# EAGLE design SimpleSwitch (EAGLE 6.4)
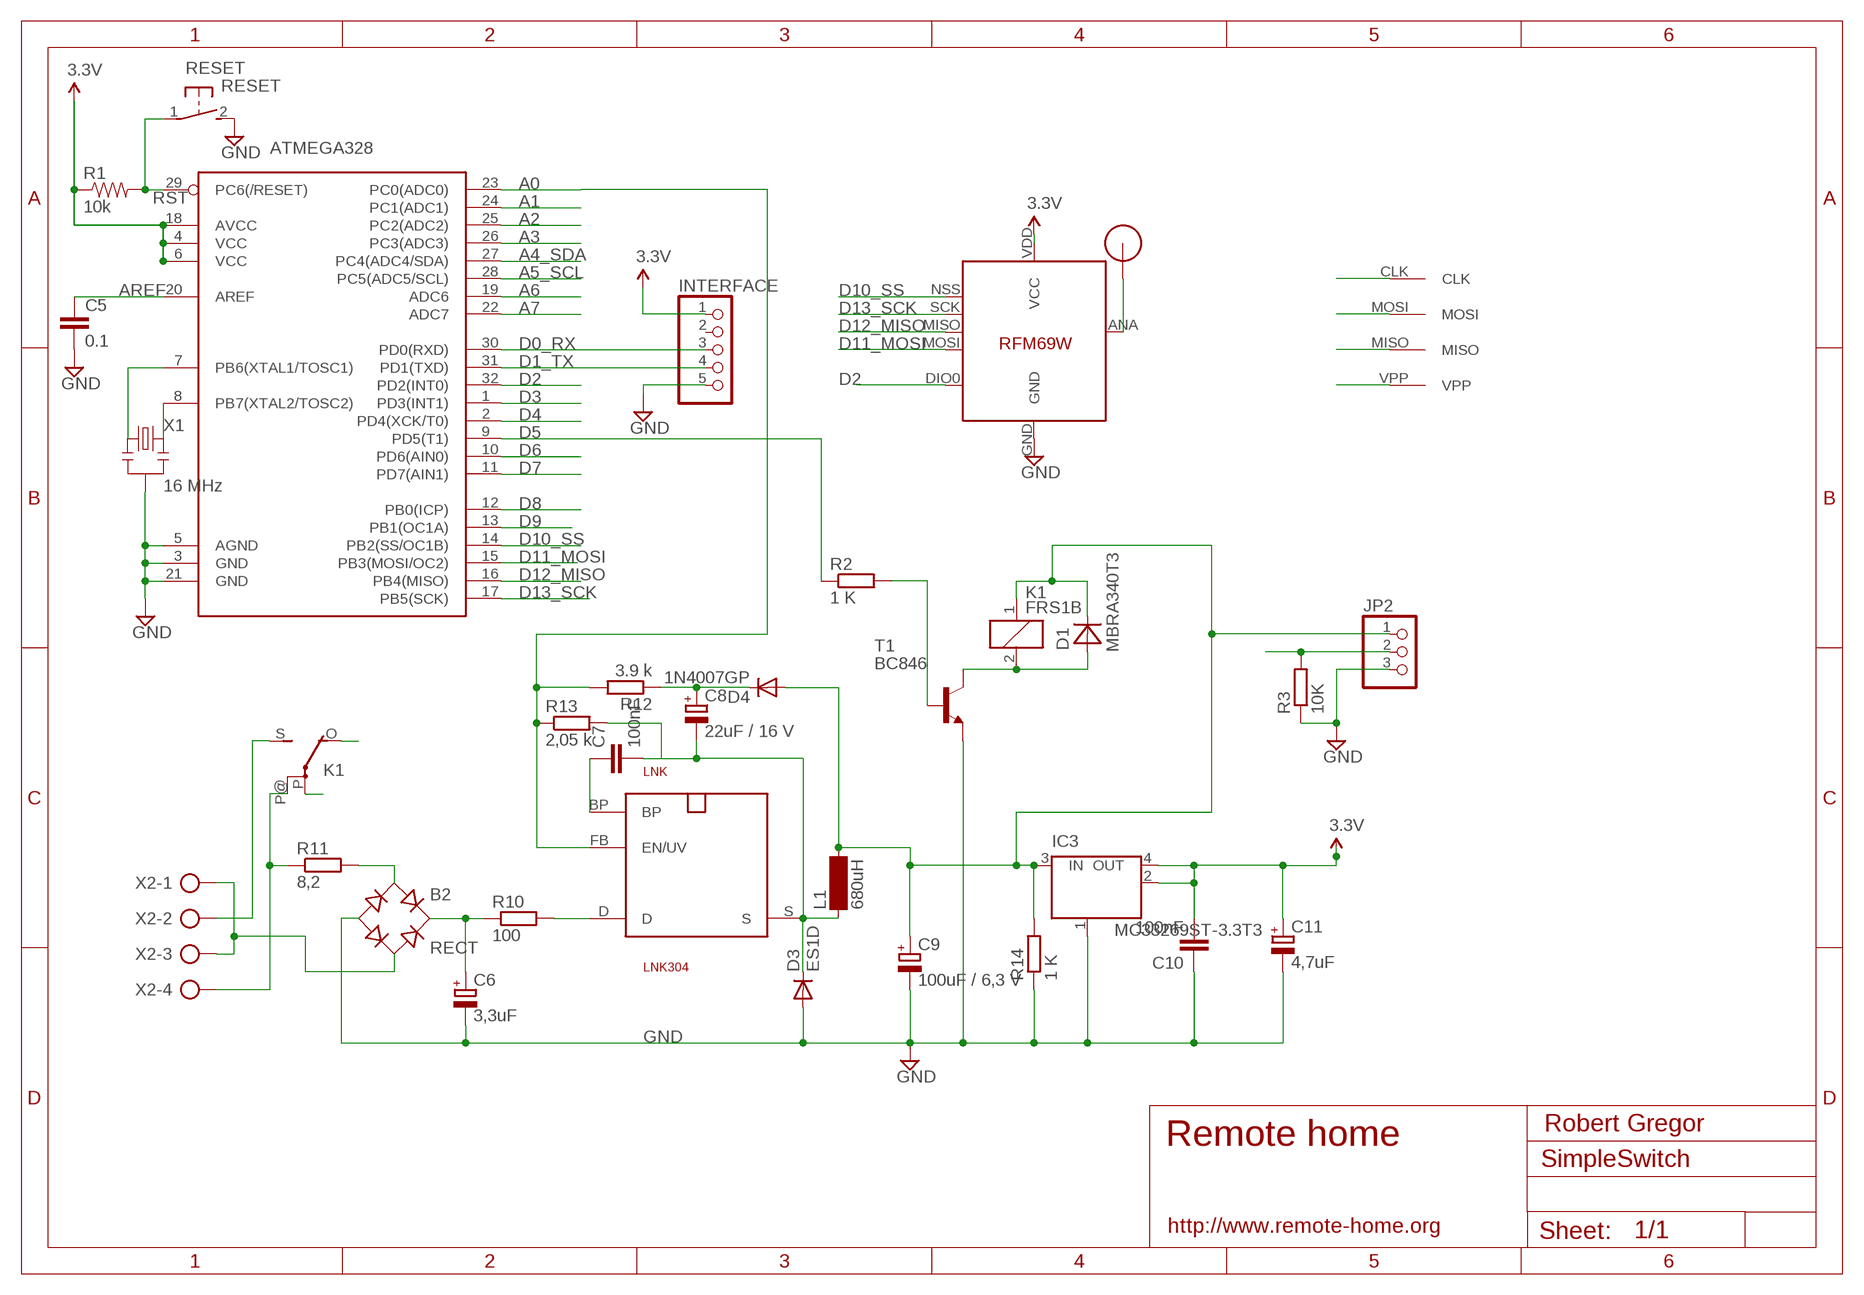
[diagram p0: schematic, sheet 1]

## Parts
ATMEGA328  ATMega-328  ATMEGA168/328TQFP32  [TQFP32-08]
B2  RECT  RECTIFIER-S40  [TO-269AA]
C5  0.1  CAP0603-CAP  [0603-CAP]
C6  3,3uF  CPOL-EUE5-10.5  [E5-10,5]
C7  100nF  C-EUC2012  [C2012]
C8  22uF / 16 V  CPOL-EUSMCC  [SMC_C]
C9  100uF / 6,3 V  CPOL-EUE2.5-5  [E2,5-5]
C10  100nF  C-EUC2012  [C2012]
C11  4,7uF  CPOL-EUSMCA  [SMC_A]
D1  MBRA340T3  [SMA]
D3  ES1D  DIODE-DO214AC  [DO214AC]
D4  1N4007GP  DIODE-DO214AA  [DO214AA]
IC3  MC33269ST-3.3T3  [SOT223]
INTERFACE  PINHD-1X5  [1X05]
JP2  PINHD-1X3  [1X03]
K1  FRS1B  [FRS1B]
L1  680uH  BS11  [BS11]
LNK  LNK304  SO-8C  [SO-8C]
R1  10k  RESISTOR0603-RES  [0603-RES]
R2  1 K  R-EU_M2012  [M2012]
R3  10K  R-EU_M2012  [M2012]
R10  100  R-EU_R2512W  [R2512W]
R11  8,2  R-EU_0411/12  [0411/12]
R12  3.9 k  R-EU_M2012  [M2012]
R13  2,05 k  R-EU_M2012  [M2012]
R14  1 K  R-EU_M2012  [M2012]
RESET  RESET  DTSM-3  [DTSM-3]
RFM69  RFM69  [RFM69W-MINPADS]
T1  BC846  [SOT23]
U$1  RFM12B_ANTENNA  [RFM12B-ANTENNA]
U$2  AVRHEADERDIP  [AVRHEADER]
X1  16 MHz  RESONATORSMD  [RESONATOR-SMD]
X2  AK500/4  [AK500/4]

## Nets
5V: C9.+ D1.C D4.A IC3.3(IN) JP2.1 K1.1 L1.2 R14.2
A0: ATMEGA328.23(PC0(ADC0)) LNK.FB(EN/UV) R12.2 R13.1
A1: ATMEGA328.24(PC1(ADC1))
A2: ATMEGA328.25(PC2(ADC2))
A3: ATMEGA328.26(PC3(ADC3))
A4_SDA: ATMEGA328.27(PC4(ADC4/SDA))
A5_SCL: ATMEGA328.28(PC5(ADC5/SCL))
A6: ATMEGA328.19(ADC6)
A7: ATMEGA328.22(ADC7)
AREF: ATMEGA328.20(AREF) C5.1
D0_RX: ATMEGA328.30(PD0(RXD)) INTERFACE.3
D1_TX: ATMEGA328.31(PD1(TXD)) INTERFACE.4
D2: ATMEGA328.32(PD2(INT0)) RFM69.DIO0
D3: ATMEGA328.1(PD3(INT1)) JP2.2 R3.2
D4: ATMEGA328.2(PD4(XCK/T0))
D5: ATMEGA328.9(PD5(T1)) R2.1
D6: ATMEGA328.10(PD6(AIN0))
D7: ATMEGA328.11(PD7(AIN1))
D8: ATMEGA328.12(PB0(ICP))
D9: ATMEGA328.13(PB1(OC1A))
D10_SS: ATMEGA328.14(PB2(SS/OC1B)) RFM69.NSS(SEL)
D11_MOSI: ATMEGA328.15(PB3(MOSI/OC2)) RFM69.MOSI U$2.MOSI
D12_MISO: ATMEGA328.16(PB4(MISO)) RFM69.MISO U$2.MISO
D13_SCK: ATMEGA328.17(PB5(SCK)) RFM69.SCK U$2.CLK
GND [power]: ATMEGA328.3(GND) ATMEGA328.5(AGND) ATMEGA328.21(GND) B2.- C5.2 C6.- C9.- C10.1 C11.- D3.A IC3.1(GND/ADJ) INTERFACE.5 JP2.3 R3.1 R14.1 RESET.2 RFM69.GND T1.2(E) X1.2
N$1: ATMEGA328.7(PB6(XTAL1/TOSC1)) X1.1
N$2: R2.2 T1.1(B)
N$3: RFM69.ANA(ANT) U$1.P$1
N$4 [220V]: K1.P(2:P)
N$5: D1.A K1.2 T1.3(C)
N$6 [220V]: K1.O(2:O)
N$7 [220V]: K1.S(2:S) X2.2
N$8 [220V]: K1.P@(2:P) R11.1 X2.4
N$9 [220V]: B2.AC2 X2.1 X2.3
N$10: C7.2 C8.- D3.C L1.1 LNK.S R13.2
N$13 [220V]: LNK.D R10.2
N$14 [220V]: B2.+ C6.+ R10.1
N$15 [220V]: B2.AC1 R11.2
N$18: C7.1 LNK.BP
N$20: C8.+ D4.C R12.1
N$21: ATMEGA328.8(PB7(XTAL2/TOSC2)) X1.3
RST: ATMEGA328.29(PC6(/RESET)) R1.2 RESET.1 U$2.VPP
VCC: ATMEGA328.4(VCC) ATMEGA328.6(VCC) ATMEGA328.18(AVCC) C10.2 C11.+ IC3.2(OUT) IC3.4(OUT) INTERFACE.1 R1.1 RFM69.VDD(VCC) ; supply symbol labelled 3.3V
Unconnected: INTERFACE.2

## Notes on the sheet
- Robert Gregor
- Remote home
- http://www.remote-home.org

## Library data of the parts
ATMEGA328 = LowPowerLab:ATMEGA168/328: Atmel 32-pin 8-bit micro, 16k flash.
B2 = rectifier:RECTIFIER-: Rectifier
C5 = LowPowerLab:CAP: Capacitor Standard 0603 ceramic capacitor, and 0.1" leaded capacitor.
C6 C8 C9 C11 = resistor:CPOL-EU: POLARIZED CAPACITOR, European symbol
C7 C10 = resistor:C-EU: CAPACITOR, European symbol
D1 = diode:MBRA340T3: Surface Mount Schottky Power Rectifier Source: http://www.onsemi.com/pub_link/Collateral/MBRA340T3-D.PDF
D3 D4 = diode:DIODE-: DIODE
IC3 = linear:MC33269ST*: Adjustable Output Low Dropout Voltage Regulator 800 mA Source: http://www.onsemi.com/pub/Collateral/MC33269-D.PDF
INTERFACE = pinhead:PINHD-1X5: PIN HEADER
JP2 = pinhead:PINHD-1X3: PIN HEADER
K1 = relay:FRS1B: RELAY 1 x switch, same as V23101-D6-A201, Siemens; OC_FARNELL: unknown; OC_NEWARK: unknown
L1 = inductor-neosid:BS: INDUCTOR nominal inductance, magnetically screened; OC_FARNELL: unknown; OC_NEWARK: unknown
LNK = powerint:SO-8C: 700V MOSFET für Schaltnetz-Trafos. Pin 3 fehlt. SMD
R1 = LowPowerLab:RESISTOR: Resistor Basic schematic elements and footprints for 0603, 1206, and PTH resistors.
R2 R3 R10-R14 = resistor:R-EU_: RESISTOR, European symbol
RESET = switch-tact:DTSM-3
RFM69 = LowPowerLab:RFM69
T1 = transistor:BC846: NPN TRANSISTOR
U$1 = LowPowerLab:RFM12B_ANTENNA
U$2 = RemoteHome:AVRHEADER
X1 = SparkFun:RESONATOR: Resonator Small SMD resonator. This is the itty bitty 10/20MHz resonators with built in caps. CSTCE10M0G55 and CSTCE20M0V53. Footprint has been reviewed closely but hasn't been tested yet.
X2 = con-ptr500:AK500/4: CONNECTOR; OC_FARNELL: unknown; OC_NEWARK: unknown

## Net classes
1 power: width 0.381 mm, clearance 0.254 mm
2 220V: width 0.381 mm, clearance 0.508 mm

## Board
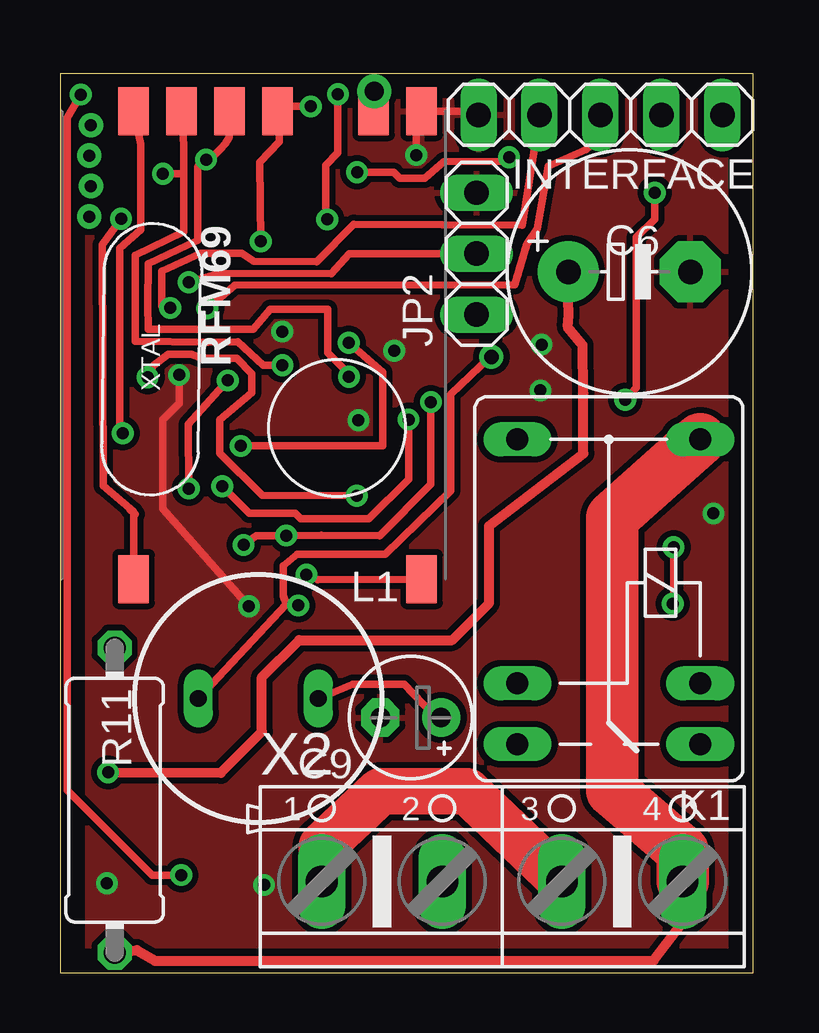
[diagram p1: board, top side]
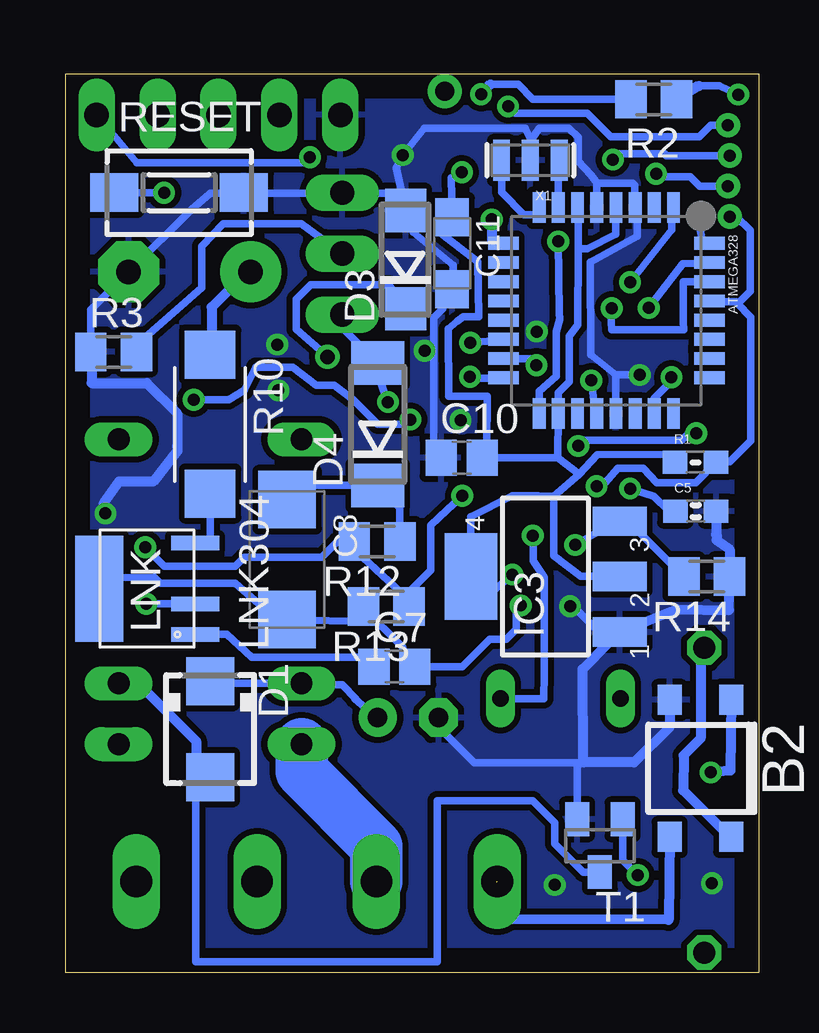
[diagram p2: board, bottom side, seen from below]

Size 28.88 x 37.45 mm. Coordinates in mm from the lower left corner, seen from the top.
Outline: 0,0 28.88,0 28.88,37.45 0,37.45 0,0
Copper layers (1*16): Top 0.035mm / dielectric 1.5mm / Bottom 0.035mm
Design rules "default": minimum track width 10mil, minimum drill 24mil, track to track 8mil, track to pad 8mil, pad to pad 8mil, via to via 8mil, smd to smd 8mil, copper to edge 40mil, drill to drill 8mil, minimum pad ring 10mil, minimum via ring 8mil, stop-mask expansion 4mil, vias tented up to drill 0mil, thermal gap 10mil

### Footprints (pad centres in the part's own frame; a part is rotated, then mirrored left to right if it is on the bottom)
TQFP32-08 = smd 1.27 x 0.533: 1 -4.293,2.8; 2 -4.293,2; 3 -4.293,1.2; 4 -4.293,0.4; 5 -4.293,-0.4; 6 -4.293,-1.2; 7 -4.293,-2; 8 -4.293,-2.8; 17 4.293,-2.8; 18 4.293,-2; 19 4.293,-1.2; 20 4.293,-0.4; 21 4.293,0.4; 22 4.293,1.2; 23 4.293,2; 24 4.293,2.8 | smd 0.533 x 1.27: 9 -2.8,-4.293; 10 -2,-4.293; 11 -1.2,-4.293; 12 -0.4,-4.293; 13 0.4,-4.293; 14 1.2,-4.293; 15 2,-4.293; 16 2.8,-4.293; 25 2.8,4.293; 26 2,4.293; 27 1.2,4.293; 28 0.4,4.293; 29 -0.4,4.293; 30 -1.2,4.293; 31 -2,4.293; 32 -2.8,4.293
TO-269AA = smd 1 x 1.25: + -1.28,-2.855; - 1.28,-2.855; AC1 -1.28,2.855; AC2 1.28,2.855
0603-CAP = smd 1.016 x 0.965: 1 -0.85,0; 2 0.85,0
E5-10,5 = drill 1.016 pad 2.54: + -2.54,0 | drill 1.016 pad 2.54 octagon: - 2.54,0
C2012 = smd 1.3 x 1.5: 1 -0.85,0; 2 0.85,0
SMC_C = smd 2.4 x 2.4: + -2.5,0; - 2.5,0
E2,5-5 = drill 0.813 pad 1.6: + -1.27,0 | drill 0.813 pad 1.6 octagon: - 1.27,0
SMC_A = smd 1.6 x 1.4: + -1.5,0; - 1.5,0
SMA = smd 2 x 2: A 2,0; C -2,0
DO214AC = smd 1.8 x 1.7: A 2.05,0; C -2.05,0
DO214AA = smd 1.8 x 2.2: A 2.55,0; C -2.55,0
SOT223 = smd 1.219 x 2.235: 1 -2.311,-3.099; 2 0,-3.099; 3 2.311,-3.099 | smd 3.6 x 2.2: 4 0,3.099
1X05 = drill 1.016 long: 1 -5.08,0; 2 -2.54,0; 3 0,0; 4 2.54,0; 5 5.08,0
1X03 = drill 1.016 long: 1 -2.54,0; 2 0,0; 3 2.54,0
FRS1B = drill 0.914 long: 1 0,3.81; 2 0,-3.81; O -2.54,-3.81; P 10.16,3.81; P@ 10.16,-3.81; S -2.54,3.81
BS11 = drill 0.7 long: 1 -2.5,0; 2 2.5,0
SO-8C = smd 0.6 x 2: BP -1.905,-2; D 1.905,-2; FB -0.635,-2 | smd 4.41 x 2: S 0,2
0603-RES = smd 1.016 x 0.965: 1 -0.85,0; 2 0.85,0
M2012 = smd 1.3 x 1.6: 1 -0.95,0; 2 0.95,0
R2512W = smd 2 x 2.1: 1 -2.896,0; 2 2.896,0
0411/12 = drill 0.914 octagon: 1 -6.35,0; 2 6.35,0
DTSM-3 = smd 2 x 1.6: 1 -2.7,0; 2 2.7,0
RFM69W-MINPADS = smd 2 x 1.27: ANA 8,-5; DIO0 -11.5,5; GND 8,-7; MISO 8,1; MOSI 8,3; NSS 8,5; SCK 8,-1; VDD -11.5,-7
SOT23 = smd 1 x 1.4: 1 -0.95,-1.1; 2 0.95,-1.1; 3 0,1.1
RFM12B-ANTENNA = drill 0.8 pad 1.422: P$1 0,0
AVRHEADER = drill 0.5: CLK 2.54,0; MISO 1.27,0.07; MOSI 0,0; VPP -1.27,0.072
RESONATOR-SMD = smd 0.7 x 1.7: 1 -1.2,0; 2 0,0; 3 1.2,0
AK500/4 = drill 1.321 long: 1 -7.518,0; 2 -2.489,0; 3 2.489,0; 4 7.518,0

### Placement (x,y rotation side)
ATMEGA328  6.35,27.59 270 bottom
B2  2.43,8.52 180 bottom
C5  2.62,19.24 0 bottom
C6  23.71,29.21 0 top
C7  15.18,12.76 0 bottom
C8  19.65,17.22 270 bottom
C9  14.61,10.63 180 top
C10  12.38,21.46 0 bottom
C11  12.78,29.98 270 bottom
D1  22.86,10.16 270 bottom
D3  14.71,29.72 90 bottom
D4  15.88,22.86 90 bottom
IC3  8.89,16.51 90 bottom
INTERFACE  22.51,35.75 180 top
JP2  17.35,29.97 90 top
K1  22.86,12.06 90 top
L1  8.26,11.43 0 top
LNK  25.49,16.01 90 bottom
R1  2.64,21.27 0 bottom
R2  4.37,36.4 0 bottom
R3  26.88,25.87 0 bottom
R10  22.86,22.86 270 bottom
R11  2.27,7.2 90 top
R12  15.9,17.98 180 bottom
R13  15.52,15.27 180 bottom
R14  2.17,16.51 180 bottom
RESET  24.15,32.51 0 bottom
RFM69  8.06,27.91 90 top
T1  6.62,5.3 180 bottom
U$1  13.08,36.73 0 top
U$2  1.28,32.78 90 top
X1  9.51,33.86 180 bottom
X2  18.41,3.81 0 top

### Tracks (layer width: path | path; a pad name or v marks a point on that pad's centre or on a via)
5V  (via drill 0.5)
  Top 0.305: v7.64,17.83 8.18,18.21 v9.42,18.22 10.88,18.23 13.31,18.2 15.45,20.35 v15.45,23.78 | C9.+ 15.88,10.4 14.34,12.02 12.18,12.02 L1.2
  Bottom 0.305: C9.+ 15.91,10.63 16.82,11.43 16.78,11.43 17.35,11.99 18.98,11.99 K1.1 22.77,12.06 D1.C | L1.2 8.95,11.43 8.94,12.47 8.94,16.49 9.39,17.16 9.39,18.25 v9.42,18.22 | v7.64,17.83 5.68,18.93 IC3.3 5.43,18.82 R14.2 | v15.45,23.78 15.88,24.95 D4.A 17.35,26.89 JP2.1
A0  (via drill 0.5)
  Top 0.305: v25.56,17.73 25.56,15.42 v25.52,15.38 | v12.35,19.88 8.42,19.91 6.66,21.64 6.65,23.05 7.99,24.17 7.99,24.97 7.34,25.61 5.91,25.61 5.45,25.78 4.5,25.78 3.9,25.31 3.65,24.84 v3.64,24.81
  Bottom 0.305: v25.56,17.73 24.76,16.94 21.81,16.94 21.43,17.31 18.21,17.31 17.54,17.98 R12.2 16.66,17.91 16.51,17.31 14.61,15.56 R13.1 14.57,15.88 13.67,16.78 13.67,18.66 v12.35,19.88 | v25.52,15.38 23.5,15.38 LNK.FB | v3.64,24.81 3.79,24.51 4.35,23.95 4.35,23.02 ATMEGA328.23
AREF  (via drill 0.5)
  Top 0.305: v5.36,20.18 5.33,22.86 v6.98,24.68
  Bottom 0.305: C5.1 3.74,19.24 4.37,19.87 v5.36,20.18 | v6.98,24.68 6.77,23.03 ATMEGA328.20
D0_RX  (via drill 0.5)
  Top 0.305: v6.12,27.69 6.35,27.85 7.28,28.66 18.93,28.66 19.44,30.37 19.87,31 20.33,33.61 21.9,34.3 22.23,34.59 22.27,35.52 INTERFACE.3
  Bottom 0.305: ATMEGA328.30 3.14,28.79 3.14,27.12 3.11,26.79 6.12,26.79 6.14,27.08 v6.12,27.69
D1_TX  (via drill 0.5)
  Top 0.305: v4.58,27.7 4.29,27.7 4.22,27.77 4.22,29.24 5.85,29.99 7.57,29.99 8.05,29.66 10.69,29.64 12.23,31.18 15.91,31.17 19.26,31.14 19.99,35.73 INTERFACE.4
  Bottom 0.305: ATMEGA328.31 3.15,29.55 v4.58,27.7
D2  (via drill 0.5)
  Top 0.305: RFM69.DIO0 3.07,18.95 3.07,19.1 3.13,19.1 2.9,19.32 3.03,19.23 1.78,20.3 1.76,30.33 v2.53,31.42
  Bottom 0.305: v2.53,31.42 2.33,30.45 2.1,30.37 2.08,30.39 ATMEGA328.32
D3  (via drill 0.5)
  Top 0.305: JP2.2 12.05,29.97 11.3,29.13 6.67,29.15 v5.36,28.77
  Bottom 0.305: v5.36,28.77 3.62,30.97 3.62,31.26 3.62,31.81 ATMEGA328.1 | R3.2 25.93,26.14 23.21,28.54 23.21,30.28 22.31,31.22 19.05,31.22 JP2.2
D5  (via drill 0.5)
  Top 0.305: v11.57,36.61 11.57,34.16 11.06,33.65 11.07,31.45
  Top 0.406: 11.07,31.45 v11.12,31.39
  Bottom 0.305: R2.1 9.41,36.4 10.03,37.02 11.18,37.02
  Bottom 0.406: 11.18,37.02 v11.57,36.61 | v11.12,31.39 11.12,30.59 ATMEGA328.9
D10_SS  (via drill 0.5)
  Top 0.305: RFM69.NSS 3.36,34.53 3.35,32.3 3.35,30.96 2.48,30.19 2.47,22.56 v2.6,22.48 | v7.52,21.96 11.61,21.95 13.44,21.96 13.43,25.03 v12.02,26.25
  Bottom 0.305: v2.6,22.48 2.92,22.48 3.21,22.19 7.33,22.19 v7.52,21.96 | v12.02,26.25 10.62,26.37 ATMEGA328.14
D11_MOSI  (via drill 0.5)
  Top 0.305: v9.26,25.31 8.45,25.32 7.4,26.3 6.15,26.28 3.13,26.31 3.13,29.9 5.15,30.87 5.14,33.39 | 5.14,33.39 5.13,35.87 RFM69.MOSI | v4.28,33.3 5.05,33.3 5.14,33.39
  Bottom 0.305: ATMEGA328.15 9.48,25.59 v9.26,25.31 | U$2.MOSI 2.46,32.78 2.86,33.18 4.28,33.18 v4.28,33.3
D12_MISO  (via drill 0.5)
  Top 0.305: RFM69.MISO 7.04,34.81 6.88,34.54 6.68,34.33 6.34,33.99 v6.08,33.89 5.74,33.58 5.74,30.53 3.67,29.55 3.65,27.85 3.67,26.82 8.04,26.82 8.76,27.65 11.15,27.66 11.14,25.85 12.03,24.96 v12.03,24.84
  Bottom 0.305: v12.03,24.84 12.04,24.77 11.46,24.77 10.51,24.77 ATMEGA328.16 | U$2.MISO 3.85,34.05 3.92,34.12 5.93,34.12 v6.08,33.89
D13_SCK  (via drill 0.5)
  Top 0.305: v8.36,30.48 8.31,33.78 9.12,34.62 9.12,35.87 RFM69.SCK 9.26,36.1 v10.44,36.1
  Bottom 0.305: ATMEGA328.17 9.15,24.23 8.43,24.85 8.43,26.71 8.29,27.23 8.31,27.5 v8.36,30.48 | U$2.CLK 1.99,35.32 2.48,34.83 6.16,34.83 7.14,35.81 10.15,35.81 v10.44,36.1
GND  (via drill 0.5)
  Top 0.305: v14.83,34.07 14.83,35.51 RFM69.GND 17.27,35.91 INTERFACE.5 | v4.95,24.91 4.95,23.73 4.27,23.05 4.27,21.23 4.27,20.7 4.27,19.34 v7.86,15.28
  Bottom 0.305: ATMEGA328.5 6.75,32.88 6.73,32.9 | 6.73,32.9 5.25,32.9 5.17,32.82 5.17,31.62 ATMEGA328.3 5.07,31.52 5.07,30.68 7.03,29.6 6.99,25.75 5.95,24.91 | 6.73,32.9 7,33.26 7.52,33.82 7.52,34.82 7.91,35.18 9.15,35.18 9.51,34.66 X1.2 9.51,34.76 9.73,35.18 13.93,35.18 v14.83,34.07 15.1,33.55 D3.A | C10.1 13.54,21.62 13.53,27.3 13.16,27.67 C11.- 12.73,29.49 14.4,30.86 14.71,31.54 D3.A | 5.95,24.91 ATMEGA328.21 5.95,24.91 | C9.- 13.25,10.16 11.85,8.75 7.41,8.75 | 7.41,8.75 7.31,8.77 | 5.95,24.91 v4.95,24.91 | v7.86,15.28 7.72,15.28 6.22,13.77 | D3.A 14.71,31.98 15.21,32.48 17.36,32.48 21.4,32.48 22.86,32.48 22.89,32.45 23.6,31.83 C6.- 27.83,27.64 R3.1 | T1.2 7.57,8.6 7.41,8.75
  Bottom 0.406: B2.- 3.72,10.24 5.2,8.77 7.31,8.77 7.33,12.65 6.22,13.77 IC3.1 3.43,15.15 1.24,15.11 R14.1 1.21,17.64 1.76,18.02 1.75,18.21 1.77,18.26 C5.2 | 17.04,32.14 17.36,32.14 17.36,32.48 | v27.22,19.14 27.3,19.14 27.28,19.2 27.28,19.58 | R3.1 27.8,25.87 27.8,24.57 25.5,24.57 24.24,23.31 24.24,21.93 24.22,21.91 24.22,21.75 25.24,20.47 26.66,20.47 27.28,19.58 | 27.28,19.58 27.28,19.15 | RESET.2 21.4,32.51 21.4,32.48
  other vias: 12.42,23.02 9.25,26.72 20.06,26.18 1.95,3.74 20.01,24.27 13.92,25.92 8.49,3.66
  pour Top: 0.13,37.3 28.75,37.3 28.75,0.13 0.13,0.13 0.13,37.23
  pour Bottom: 0.19,37.3 28.75,37.3 28.75,0.13 0.16,0.13 0.16,37.33
N$1
  Bottom 0.305: ATMEGA328.7 8.35,33.48 X1.1
N$2  (via drill 0.5)
  Top 0.305: v5.04,4.07 3.84,4.07 0.29,7.62 0.29,35.62 v0.86,36.59
  Bottom 0.305: 2.5,36.96 1.64,36.96 v0.86,36.59 | T1.1 5.67,4.7 v5.04,4.07
  Bottom 0.406: 2.5,36.96 R2.2
N$3
  Top 0.406: RFM69.ANA 13.12,35.87 U$1.P$1
N$5
  Bottom 0.305: T1.3 7.32,4.2 8.49,5.37 8.49,6.26 9.41,7.17 13.39,7.17 13.39,0.47 23.45,0.47 23.45,8.15 22.86,8.15 D1.A
  Bottom 0.406: K1.2 25.84,12.06 23.44,9.66 23.44,8.74 D1.A
N$7
  Bottom 2.184: K1.S 19.05,8.41 15.93,5.28 X2.2
N$8
  Top 0.406: R11.1 3.19,0.94 3.95,0.5 24.72,0.5 25.99,2.18 25.99,3.75 X2.4
  Top 2.184: X2.4 25.93,5.06 22.99,7.59 22.99,18.96 K1.P@
N$9  (1 unrouted)
  Top 1.93: X2.1 10.9,5.27 13.33,7.56 16.95,7.56 X2.3
  Bottom 0.406: B2.AC2 3.75,2.21 10.9,2.23 X2.1
N$10  (via drill 0.5, 0.6)
  Top 0.305: v9.92,15.31 9.41,15.35 | 9.41,15.35 L1.1 | v17.97,25.67 17.9,25.64 16.27,24.11 16.27,20.08 13.54,17.45 9.87,17.44 9.29,16.96 9.29,15.71 9.41,15.35
  Bottom 0.305: LNK.S 26.88,16.47 25.18,16.48 24.94,16.24 23.95,16.24 21.81,16.23 20,14.64 C8.- 17.02,14.64 R13.2 16.47,15.19 14.84,13.56 14.84,13.27 C7.2 12.35,12.76 11.21,13.9 10.53,13.9 10.11,14.32 10.11,15.15 10.07,15.08 v9.92,15.31 | D3.C 15.4,28.68 18.66,28.68 19.28,28.06 19.28,26.81 v17.97,25.67
N$13
  Bottom 0.305: R10.2 22.86,17.88 LNK.D
N$14  (via drill 0.5)
  Top 0.406: v2,8.35 6.69,8.34 8.41,10.05 8.41,12.32 9.95,13.87 16.33,13.87 17.88,15.41 17.88,18.63 21.8,21.64 21.8,24.15 21.77,26.16 21.15,26.89 21.18,27.42 21.15,28.62 C6.+
  Bottom 0.406: C6.+ 21.31,29.21 22.79,27.73 22.79,25.82 R10.1 | B2.+ 1.18,8.42 v2,8.35
N$15
  Bottom 0.406: R11.2 2.42,13.55 2.42,9.77 3.13,9.06 3.15,7.61 1.12,5.59 1.15,5.4 B2.AC1
N$18
  Bottom 0.305: LNK.BP 22.16,14.1 21.13,13.15 15.73,13.15 C7.1
N$20
  Bottom 0.305: R12.1 14.95,19.38 D4.C 19.06,20.31 C8.+
N$21
  Bottom 0.305: X1.3 10.71,32.52 9.79,31.6 9.15,31.6 ATMEGA328.8
RST  (via drill 0.5)
  Top 0.305: v24.78,32.5 24.78,31.41 24.01,30.64 24.01,24.38 v23.54,23.88 | v14.51,23.05 14.51,20.57 12.86,18.92 10.03,18.92 9.79,19.16 7.88,19.16 v6.75,20.28
  Bottom 0.305: 0.87,27.89 0.34,27.32 0.34,22.16 1.21,21.29 1.85,21.29 1.83,21.27 R1.2 2.63,20.43 4.25,20.43 4.81,21.02 5.87,21.02 6.52,20.28 v6.75,20.28 | 0.87,27.89 0.93,27.96 2.26,27.96 ATMEGA328.29 | RESET.1 v24.78,32.51 v24.78,32.5 | v23.54,23.88 22.07,23.89 21.43,24.27 20.96,25.24 19.41,25.24 18.44,24.49 17.68,24.49 16.9,23.88 15.87,22.85 14.72,22.85 v14.51,23.05 | U$2.VPP 0.93,31.51 0.35,30.94 0.35,28.4 0.87,27.89
VCC  (via drill 0.5)
  Top 0.305: RFM69.VDD 10.72,16.37 v10.26,16.59 | v12.37,33.36 13.9,33.36 14.15,33.1 15.19,33.1 15.98,33.8 18.33,33.81 v18.7,33.98
  Bottom 0.305: R1.1 3.49,21.5 3.6,21.61 6.72,21.59 7.47,20.78 | 7.47,20.78 8.54,19.86 | 8.54,19.86 8.54,17.38 7.42,16.52 IC3.2 | 8.37,21.45 ATMEGA328.18 8.35,24.18 7.89,24.64 7.9,26.52 7.53,27.01 7.52,30.16 | 8.37,21.45 7.47,20.78 | 8.37,21.45 8.62,21.46 C10.2 11.32,21.47 11.32,22.25 11.31,23.64 11.31,24.02 12.91,24.02 12.93,26.83 12.55,27.14 12.3,27.33 11.67,27.33 11.7,29.64 13.16,30.75 C11.+ 12.81,33.14 v12.37,33.36 | 8.54,19.86 9.18,19.87 10.27,19.87 11.99,19.01 IC3.4 11.24,15.76 v10.26,16.59 | 7.52,30.16 7.52,31.44 ATMEGA328.6 | ATMEGA328.4 5.95,30.78 7.15,30.16 7.52,30.16 | INTERFACE.1 25.91,33.76 19.02,33.76 18.8,33.98 v18.7,33.98